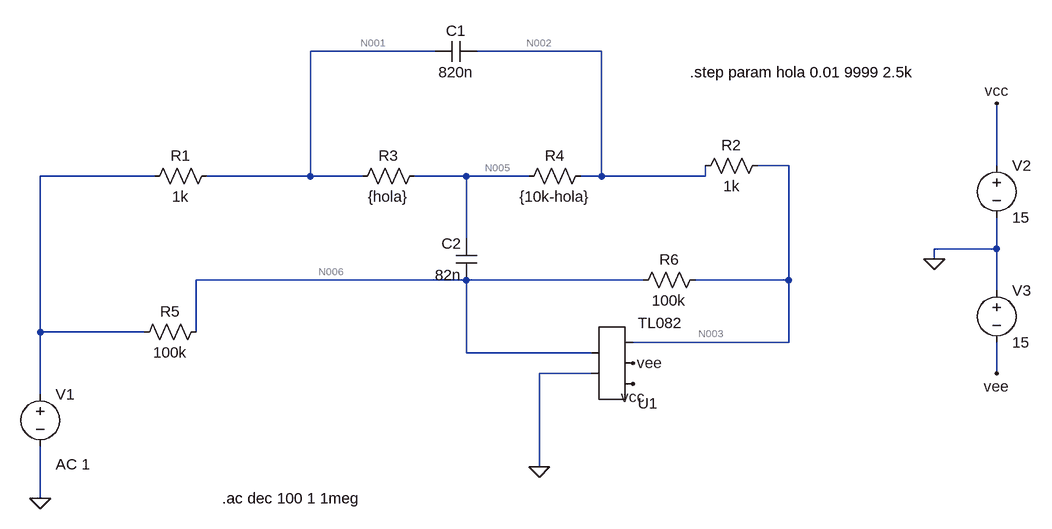
[diagram p0: schematic Spice.asc]
* Spice.asc
R1 N001 N004 1k
R2 N003 N002 1k
R3 N005 N001 {hola}
R4 N002 N005 {10k-hola}
R5 N006 N004 100k
R6 N003 N006 100k
C1 N002 N001 820n
C2 N006 N005 82n
V1 N004 0 AC 1
V2 vcc 0 15
V3 0 vee 15
* U1: TL082 (symbol AutoGenerated\TL082 not available, pins judged from their places): pin1=0 pin2=N006 pin3=vcc pin4=vee pin5=N003
.ac dec 100 1 1meg
.step param hola 0.01 9999 2.5k
.backanno
.end

* Results of the author's LTspice run, read from the files saved beside the schematic
* Operating Point (first step), zero values left out:
*   hola = 10 m
*   V(n001) = 2.204 µV
*   V(n003) = 26.45 µV
*   V(n002) = 24.24 µV
*   V(n005) = 2.204 µV
*   V(n006) = 10.97 µV
*   V(vcc) = 15 V
*   V(vee) = -15 V
*   I(R6) = 154.8 pA
*   I(R5) = 109.7 pA
*   I(R4) = 2.204 nA
*   I(R3) = 2.204 nA
*   I(R2) = 2.204 nA
*   I(R1) = 2.204 nA
*   I(V3) = -14.19 mA
*   I(V2) = -14.19 mA
*   I(V1) = 2.314 nA
*   Ix(u1:1) = 45.05 pA
*   Ix(u1:2) = 45.05 pA
*   Ix(u1:3) = 14.19 mA
*   Ix(u1:4) = -14.19 mA
*   Ix(u1:5) = -2.359 nA
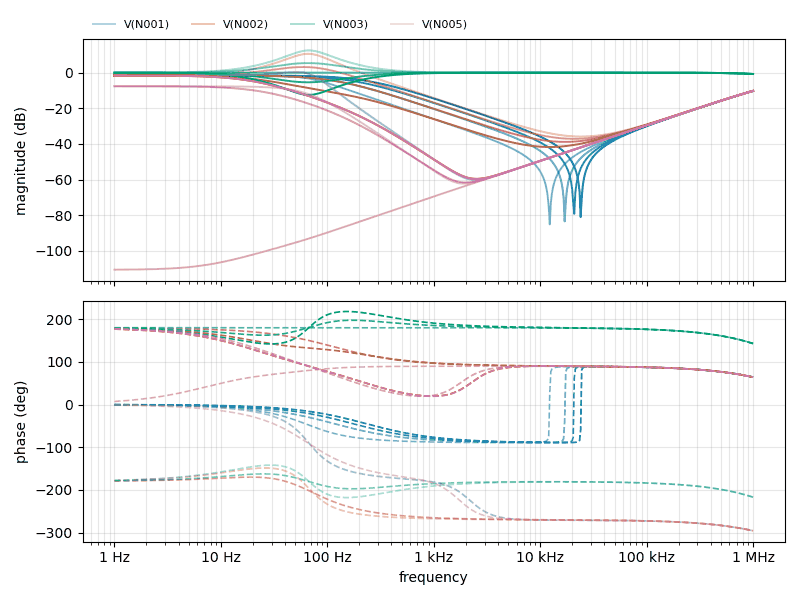
[diagram p1: AC Analysis of Spice.asc, plotted from the saved traces]
* AC Analysis, 5 runs:
*   V(N001) [hola=0.01]: -1.58 dB at 1 Hz, -10.23 dB at 1 MHz, peak 0.36 dB at 51.29 Hz, 3 dB below the peak at 79.16 Hz
*   V(N001) [hola=2500.01]: -1.58 dB at 1 Hz, -10.23 dB at 1 MHz, peak -1.55 dB at 18.62 Hz, 3 dB below the peak at 83.41 Hz
*   V(N001) [hola=5000.01]: -1.58 dB at 1 Hz, -10.23 dB at 1 MHz, peak -1.58 dB at 1 Hz, 3 dB below the peak at 116.4 Hz
*   V(N001) [hola=7500.01]: -1.58 dB at 1 Hz, -10.23 dB at 1 MHz, peak -1.58 dB at 1 Hz, 3 dB below the peak at 169.8 Hz
*   V(N001) [hola=9999]: -1.58 dB at 1 Hz, -10.23 dB at 1 MHz, peak -1.58 dB at 1 Hz, 3 dB below the peak at 233.1 Hz
*   V(N002) [hola=0.01]: -1.57 dB at 1 Hz, -10.22 dB at 1 MHz, peak 10.58 dB at 66.07 Hz, 3 dB below the peak at 41.42 Hz and 101.3 Hz
*   V(N002) [hola=2500.01]: -1.58 dB at 1 Hz, -10.23 dB at 1 MHz, peak 3.18 dB at 58.88 Hz, 3 dB below the peak at 19.28 Hz and 128.9 Hz
*   V(N002) [hola=5000.01]: -1.58 dB at 1 Hz, -10.23 dB at 1 MHz, peak -1.58 dB at 1 Hz, 3 dB below the peak at 116.5 Hz
*   V(N002) [hola=7500.01]: -1.59 dB at 1 Hz, -10.23 dB at 1 MHz, peak -1.59 dB at 1 Hz, 3 dB below the peak at 27.41 Hz
*   V(N002) [hola=9999]: -1.60 dB at 1 Hz, -10.23 dB at 1 MHz, peak -1.60 dB at 1 Hz, 3 dB below the peak at 19.16 Hz
*   V(N003) [hola=0.01]: 0.01 dB at 1 Hz, -0.74 dB at 1 MHz, peak 12.49 dB at 67.61 Hz, 3 dB below the peak at 42.31 Hz and 105.8 Hz
*   V(N003) [hola=2500.01]: 0.01 dB at 1 Hz, -0.74 dB at 1 MHz, peak 5.40 dB at 66.07 Hz, 3 dB below the peak at 22.95 Hz and 188 Hz
*   V(N003) [hola=5000.01]: -0.00 dB at 1 Hz, -0.74 dB at 1 MHz, peak -0.00 dB at 1.122 kHz
*   V(N003) [hola=7500.01]: -0.01 dB at 1 Hz, -0.74 dB at 1 MHz, peak -0.00 dB at 19.95 kHz, 3 dB below the peak at 157.6 Hz
*   V(N003) [hola=9999]: -0.01 dB at 1 Hz, -0.74 dB at 1 MHz, peak -0.00 dB at 23.99 kHz, 3 dB below the peak at 254.8 Hz
*   V(N005) [hola=0.01]: -1.58 dB at 1 Hz, -10.23 dB at 1 MHz, peak 0.36 dB at 51.29 Hz, 3 dB below the peak at 79.16 Hz
*   V(N005) [hola=2500.01]: -7.60 dB at 1 Hz, -10.23 dB at 1 MHz, peak -7.60 dB at 1 Hz, 3 dB below the peak at 55.67 Hz
*   V(N005) [hola=5000.01]: -110.61 dB at 1 Hz, -10.23 dB at 1 MHz, peak -10.23 dB at 1 MHz, 3 dB below the peak at 677.4 kHz
*   V(N005) [hola=7500.01]: -7.61 dB at 1 Hz, -10.23 dB at 1 MHz, peak -7.61 dB at 1 Hz, 3 dB below the peak at 24.17 Hz
*   V(N005) [hola=9999]: -1.60 dB at 1 Hz, -10.23 dB at 1 MHz, peak -1.60 dB at 1 Hz, 3 dB below the peak at 19.16 Hz